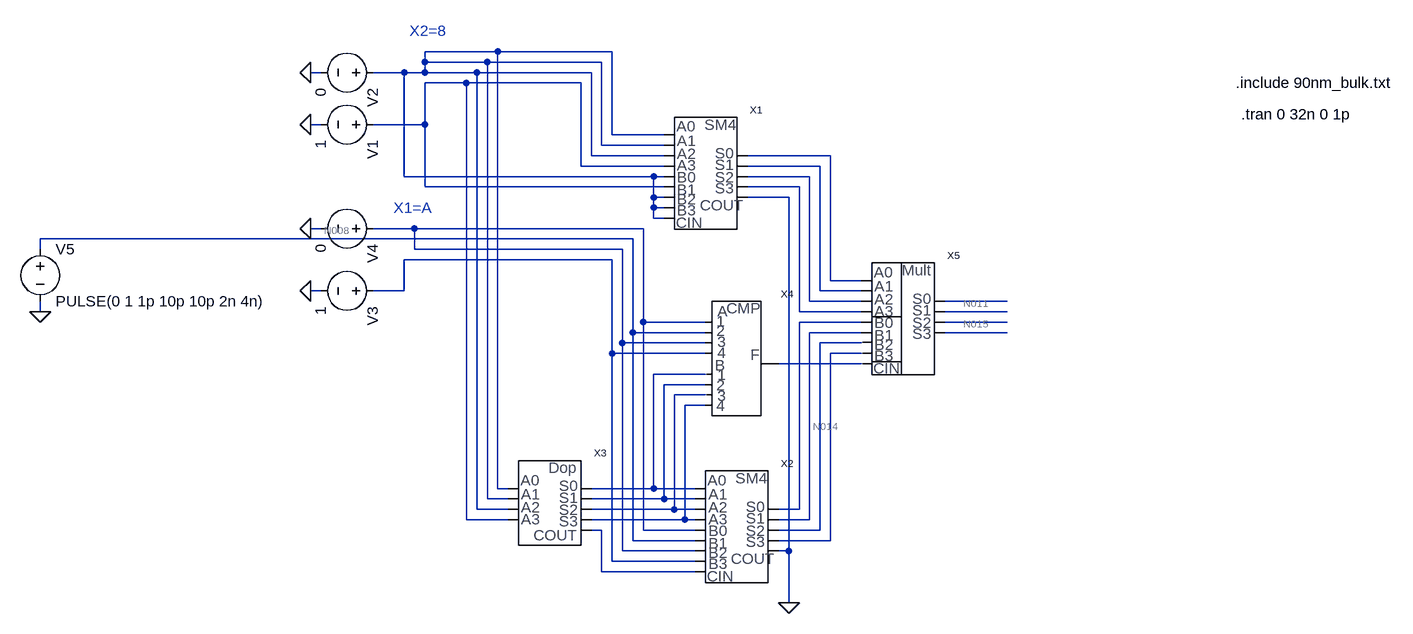
[diagram p0: schematic Final.asc]
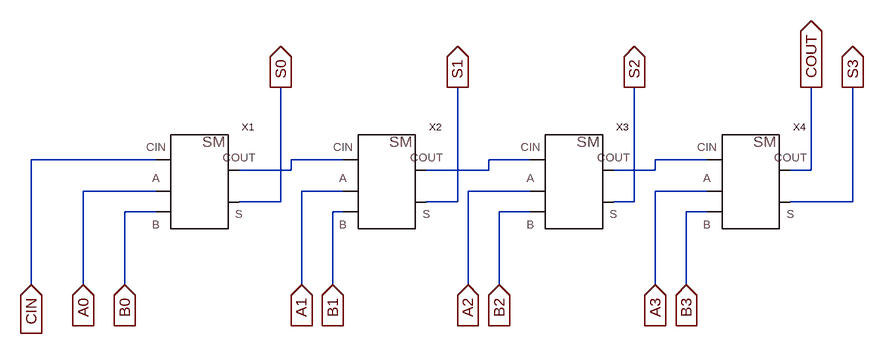
[diagram p1: sub-circuit sum4.asc]
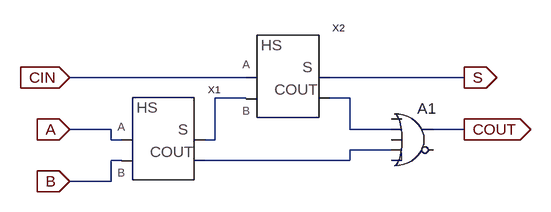
[diagram p2: sub-circuit fullsum.asc]
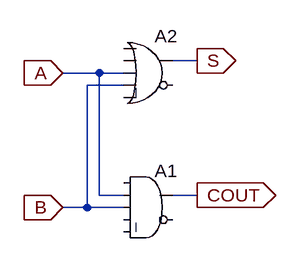
[diagram p3: sub-circuit halfsum.asc]
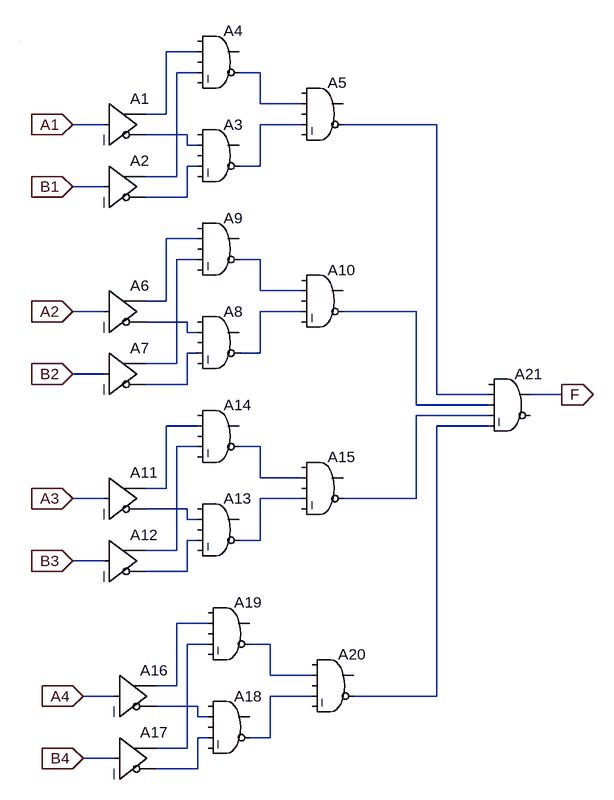
[diagram p4: sub-circuit comparator.asc]
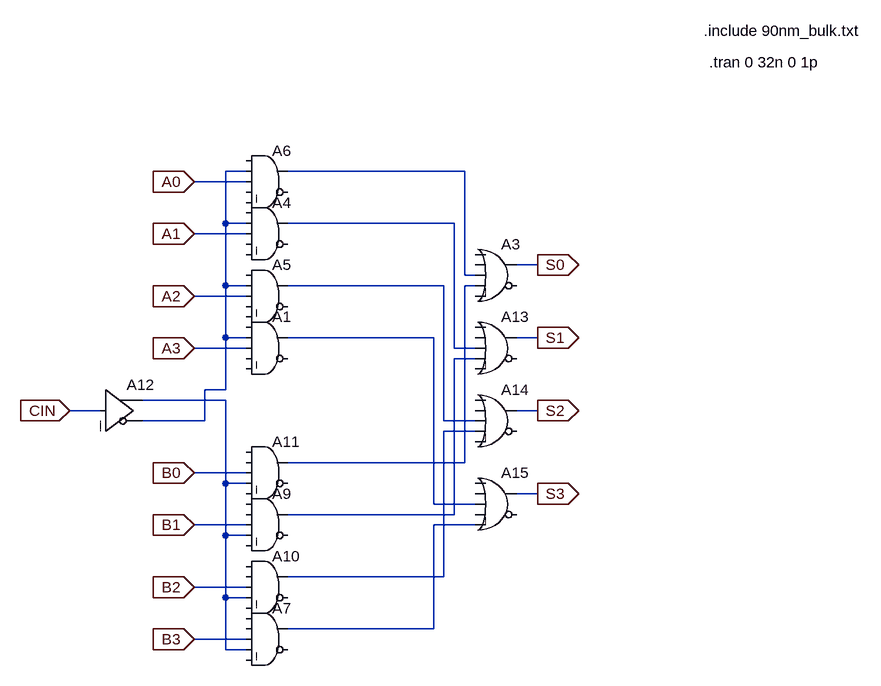
[diagram p5: sub-circuit multy.asc]
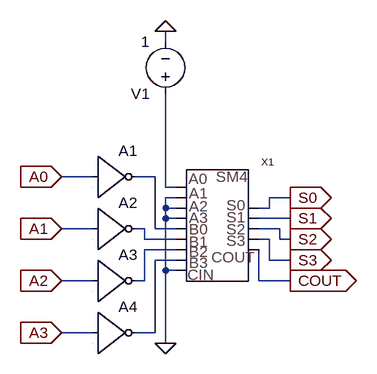
[diagram p6: sub-circuit dopcode.asc]
Final.asc, the LTspice schematic file:
Version 4
SHEET 1 1272 756
WIRE -496 -384 -608 -384
WIRE -320 -384 -496 -384
WIRE -608 -368 -608 -384
WIRE -512 -368 -608 -368
WIRE -336 -368 -512 -368
WIRE -768 -352 -784 -352
WIRE -640 -352 -688 -352
WIRE -608 -352 -608 -368
WIRE -608 -352 -640 -352
WIRE -528 -352 -608 -352
WIRE -352 -352 -528 -352
WIRE -544 -336 -608 -336
WIRE -368 -336 -544 -336
WIRE -768 -272 -784 -272
WIRE -608 -272 -608 -336
WIRE -608 -272 -688 -272
WIRE -320 -256 -320 -384
WIRE -240 -256 -320 -256
WIRE -336 -240 -336 -368
WIRE -240 -240 -336 -240
WIRE -352 -224 -352 -352
WIRE -240 -224 -352 -224
WIRE 16 -224 -112 -224
WIRE -368 -208 -368 -336
WIRE -240 -208 -368 -208
WIRE 0 -208 -112 -208
WIRE -640 -192 -640 -352
WIRE -256 -192 -640 -192
WIRE -240 -192 -256 -192
WIRE -16 -192 -112 -192
WIRE -608 -176 -608 -272
WIRE -240 -176 -608 -176
WIRE -32 -176 -112 -176
WIRE -256 -160 -256 -192
WIRE -240 -160 -256 -160
WIRE -48 -160 -112 -160
WIRE -256 -144 -256 -160
WIRE -240 -144 -256 -144
WIRE -256 -128 -256 -144
WIRE -240 -128 -256 -128
WIRE -768 -112 -784 -112
WIRE -624 -112 -688 -112
WIRE -272 -112 -624 -112
WIRE -288 -96 -1200 -96
WIRE -1200 -80 -1200 -96
WIRE -624 -80 -624 -112
WIRE -304 -80 -624 -80
WIRE -320 -64 -640 -64
WIRE 16 -32 16 -224
WIRE 64 -32 16 -32
WIRE -768 -16 -784 -16
WIRE -640 -16 -640 -64
WIRE -640 -16 -688 -16
WIRE 0 -16 0 -208
WIRE 64 -16 0 -16
WIRE -16 0 -16 -192
WIRE 64 0 -16 0
WIRE 288 0 192 0
WIRE -1200 16 -1200 0
WIRE -32 16 -32 -176
WIRE 64 16 -32 16
WIRE 288 16 192 16
WIRE -272 32 -272 -112
WIRE -176 32 -272 32
WIRE 64 32 -32 32
WIRE 288 32 192 32
WIRE -288 48 -288 -96
WIRE -176 48 -288 48
WIRE 64 48 -16 48
WIRE 288 48 192 48
WIRE -304 64 -304 -80
WIRE -176 64 -304 64
WIRE 64 64 0 64
WIRE -320 80 -320 -64
WIRE -176 80 -320 80
WIRE 64 80 16 80
WIRE 64 96 -64 96
WIRE -176 112 -256 112
WIRE -176 128 -240 128
WIRE -176 144 -224 144
WIRE -176 160 -208 160
WIRE -496 288 -496 -384
WIRE -480 288 -496 288
WIRE -256 288 -256 112
WIRE -256 288 -352 288
WIRE -192 288 -256 288
WIRE -512 304 -512 -368
WIRE -480 304 -512 304
WIRE -240 304 -240 128
WIRE -240 304 -352 304
WIRE -192 304 -240 304
WIRE -528 320 -528 -352
WIRE -480 320 -528 320
WIRE -224 320 -224 144
WIRE -224 320 -352 320
WIRE -192 320 -224 320
WIRE -32 320 -32 32
WIRE -32 320 -64 320
WIRE -544 336 -544 -336
WIRE -480 336 -544 336
WIRE -208 336 -208 160
WIRE -208 336 -352 336
WIRE -192 336 -208 336
WIRE -16 336 -16 48
WIRE -16 336 -64 336
WIRE -336 352 -352 352
WIRE -272 352 -272 32
WIRE -192 352 -272 352
WIRE 0 352 0 64
WIRE 0 352 -64 352
WIRE -288 368 -288 48
WIRE -192 368 -288 368
WIRE 16 368 16 80
WIRE 16 368 -64 368
WIRE -304 384 -304 64
WIRE -192 384 -304 384
WIRE -48 384 -48 -160
WIRE -48 384 -64 384
WIRE -320 400 -320 80
WIRE -192 400 -320 400
WIRE -336 416 -336 352
WIRE -192 416 -336 416
WIRE -48 464 -48 384
FLAG -784 -272 0
FLAG -784 -352 0
FLAG -784 -16 0
FLAG -784 -112 0
FLAG -48 464 0
FLAG -1200 16 0
SYMBOL SUM4 -160 -192 R0
SYMATTR InstName X1
SYMBOL SUM4 -112 352 R0
SYMATTR InstName X2
SYMBOL comparator -128 96 R0
SYMATTR InstName X4
SYMBOL voltage -672 -272 R90
WINDOW 123 0 0 Left 2
WINDOW 39 0 0 Left 2
SYMATTR InstName V1
SYMATTR Value 1
SYMBOL voltage -672 -352 R90
WINDOW 123 0 0 Left 2
WINDOW 39 0 0 Left 2
SYMATTR InstName V2
SYMATTR Value 0
SYMBOL voltage -672 -16 R90
WINDOW 123 0 0 Left 2
WINDOW 39 0 0 Left 2
SYMATTR InstName V3
SYMATTR Value 1
SYMBOL voltage -672 -112 R90
WINDOW 123 0 0 Left 2
WINDOW 39 0 0 Left 2
SYMATTR InstName V4
SYMATTR Value 0
SYMBOL Multy 144 32 R0
SYMATTR InstName X5
SYMBOL DopCode -400 336 R0
SYMATTR InstName X3
SYMBOL voltage -1200 -96 R0
WINDOW 123 0 0 Left 2
WINDOW 39 0 0 Left 2
SYMATTR InstName V5
SYMATTR Value PULSE(0 1 1p 10p 10p 2n 4n)
TEXT 640 -336 Left 2 !.include 90nm_bulk.txt
TEXT 648 -288 Left 2 !.tran 0 32n 0 1p
TEXT -632 -416 Left 2 ;X2=8
TEXT -656 -144 Left 2 ;X1=A

sum4.asc, the sub-circuit schematic file:
Version 4
SHEET 1 1244 680
WIRE 96 128 -96 128
WIRE 384 128 304 128
WIRE 672 128 608 128
WIRE 944 128 864 128
WIRE 304 144 304 128
WIRE 304 144 224 144
WIRE 608 144 608 128
WIRE 608 144 512 144
WIRE 864 144 864 128
WIRE 864 144 800 144
WIRE 1104 144 1104 16
WIRE 1104 144 1072 144
WIRE 96 176 -16 176
WIRE 384 176 320 176
WIRE 672 176 576 176
WIRE 944 176 864 176
WIRE 288 192 288 16
WIRE 288 192 224 192
WIRE 560 192 560 16
WIRE 560 192 512 192
WIRE 832 192 832 16
WIRE 832 192 800 192
WIRE 1168 192 1168 16
WIRE 1168 192 1072 192
WIRE 96 208 48 208
WIRE 384 208 368 208
WIRE 672 208 624 208
WIRE 944 208 912 208
WIRE -96 320 -96 128
WIRE -16 320 -16 176
WIRE 48 320 48 208
WIRE 320 320 320 176
WIRE 368 320 368 208
WIRE 576 320 576 176
WIRE 624 320 624 208
WIRE 864 320 864 176
WIRE 912 320 912 208
FLAG -16 320 A0
IOPIN -16 320 In
FLAG 320 320 A1
IOPIN 320 320 In
FLAG 576 320 A2
IOPIN 576 320 In
FLAG 864 320 A3
IOPIN 864 320 In
FLAG -96 320 CIN
IOPIN -96 320 In
FLAG 48 320 B0
IOPIN 48 320 In
FLAG 368 320 B1
IOPIN 368 320 In
FLAG 624 320 B2
IOPIN 624 320 In
FLAG 912 320 B3
IOPIN 912 320 In
FLAG 288 16 S0
IOPIN 288 16 Out
FLAG 560 16 S1
IOPIN 560 16 Out
FLAG 832 16 S2
IOPIN 832 16 Out
FLAG 1104 16 COUT
IOPIN 1104 16 Out
FLAG 1168 16 S3
IOPIN 1168 16 Out
SYMBOL fullsum 160 160 R0
SYMATTR InstName X1
SYMBOL fullsum 448 160 R0
SYMATTR InstName X2
SYMBOL fullsum 736 160 R0
SYMATTR InstName X3
SYMBOL fullsum 1008 160 R0
SYMATTR InstName X4

fullsum.asc, the sub-circuit schematic file:
Version 4
SHEET 1 880 680
WIRE 400 64 128 64
WIRE 736 64 528 64
WIRE 400 96 352 96
WIRE 560 96 528 96
WIRE 192 144 128 144
WIRE 560 144 560 96
WIRE 624 144 560 144
WIRE 736 144 688 144
WIRE 192 160 192 144
WIRE 208 160 192 160
WIRE 352 160 352 96
WIRE 352 160 336 160
WIRE 624 176 560 176
WIRE 208 192 192 192
WIRE 560 192 560 176
WIRE 560 192 336 192
WIRE 192 224 192 192
WIRE 192 224 128 224
FLAG 128 144 A
IOPIN 128 144 In
FLAG 128 224 B
IOPIN 128 224 In
FLAG 128 64 CIN
IOPIN 128 64 In
FLAG 736 144 COUT
IOPIN 736 144 Out
FLAG 736 64 S
IOPIN 736 64 Out
SYMBOL halfsum 240 176 R0
SYMATTR InstName X1
SYMBOL halfsum 432 80 R0
SYMATTR InstName X2
SYMBOL Digital\\or 656 96 R0
SYMATTR InstName A1

halfsum.asc, the sub-circuit schematic file:
Version 4
SHEET 1 880 680
WIRE 272 -48 240 -48
WIRE 144 -32 96 -32
WIRE 176 -32 144 -32
WIRE 176 -16 128 -16
WIRE 144 128 144 -32
WIRE 176 128 144 128
WIRE 272 128 240 128
WIRE 128 144 128 -16
WIRE 128 144 96 144
WIRE 176 144 128 144
FLAG 96 -32 A
IOPIN 96 -32 In
FLAG 96 144 B
IOPIN 96 144 In
FLAG 272 -48 S
IOPIN 272 -48 Out
FLAG 272 128 COUT
IOPIN 272 128 Out
SYMBOL Digital\\and 208 80 R0
SYMATTR InstName A1
SYMBOL Digital\\or 208 -96 R0
SYMATTR InstName A2

comparator.asc, the sub-circuit schematic file:
Version 4
SHEET 1 900 1176
WIRE 272 16 224 16
WIRE 272 48 240 48
WIRE 368 48 336 48
WIRE 368 96 368 48
WIRE 432 96 368 96
WIRE 224 112 224 16
WIRE 224 112 192 112
WIRE 128 128 80 128
WIRE 432 128 368 128
WIRE 640 128 496 128
WIRE 256 144 192 144
WIRE 256 160 256 144
WIRE 272 160 256 160
WIRE 272 192 256 192
WIRE 368 192 368 128
WIRE 368 192 336 192
WIRE 240 208 240 48
WIRE 240 208 192 208
WIRE 128 224 80 224
WIRE 256 240 256 192
WIRE 256 240 192 240
WIRE 272 304 224 304
WIRE 272 336 240 336
WIRE 368 336 336 336
WIRE 368 384 368 336
WIRE 432 384 368 384
WIRE 224 400 224 304
WIRE 224 400 192 400
WIRE 128 416 80 416
WIRE 432 416 368 416
WIRE 608 416 496 416
WIRE 256 432 192 432
WIRE 256 448 256 432
WIRE 272 448 256 448
WIRE 272 480 256 480
WIRE 368 480 368 416
WIRE 368 480 336 480
WIRE 240 496 240 336
WIRE 240 496 192 496
WIRE 128 512 80 512
WIRE 256 528 256 480
WIRE 256 528 192 528
WIRE 640 544 640 128
WIRE 720 544 640 544
WIRE 832 544 784 544
WIRE 608 560 608 416
WIRE 720 560 608 560
WIRE 720 576 608 576
WIRE 272 592 224 592
WIRE 720 592 640 592
WIRE 272 624 240 624
WIRE 368 624 336 624
WIRE 368 672 368 624
WIRE 432 672 368 672
WIRE 224 688 224 592
WIRE 224 688 192 688
WIRE 128 704 80 704
WIRE 432 704 368 704
WIRE 608 704 608 576
WIRE 608 704 496 704
WIRE 256 720 192 720
WIRE 256 736 256 720
WIRE 272 736 256 736
WIRE 272 768 256 768
WIRE 368 768 368 704
WIRE 368 768 336 768
WIRE 240 784 240 624
WIRE 240 784 192 784
WIRE 128 800 80 800
WIRE 256 816 256 768
WIRE 256 816 192 816
WIRE 288 896 240 896
WIRE 288 928 256 928
WIRE 384 928 352 928
WIRE 384 976 384 928
WIRE 448 976 384 976
WIRE 240 992 240 896
WIRE 240 992 208 992
WIRE 144 1008 96 1008
WIRE 448 1008 384 1008
WIRE 640 1008 640 592
WIRE 640 1008 512 1008
WIRE 272 1024 208 1024
WIRE 272 1040 272 1024
WIRE 288 1040 272 1040
WIRE 288 1072 272 1072
WIRE 384 1072 384 1008
WIRE 384 1072 352 1072
WIRE 256 1088 256 928
WIRE 256 1088 208 1088
WIRE 144 1104 96 1104
WIRE 272 1120 272 1072
WIRE 272 1120 208 1120
WIRE 0 0 0 0
FLAG 80 128 A1
IOPIN 80 128 In
FLAG 80 224 B1
IOPIN 80 224 In
FLAG 80 416 A2
IOPIN 80 416 In
FLAG 80 512 B2
IOPIN 80 512 In
FLAG 80 704 A3
IOPIN 80 704 In
FLAG 80 800 B3
IOPIN 80 800 In
FLAG 96 1008 A4
IOPIN 96 1008 In
FLAG 96 1104 B4
IOPIN 96 1104 In
FLAG 832 544 F
IOPIN 832 544 Out
SYMBOL Digital\\buf 128 64 R0
SYMATTR InstName A1
SYMBOL Digital\\buf 128 160 R0
SYMATTR InstName A2
SYMBOL Digital\\and 304 112 R0
SYMATTR InstName A3
SYMBOL Digital\\and 304 -32 R0
SYMATTR InstName A4
SYMBOL Digital\\and 464 48 R0
SYMATTR InstName A5
SYMBOL Digital\\buf 128 352 R0
SYMATTR InstName A6
SYMBOL Digital\\buf 128 448 R0
SYMATTR InstName A7
SYMBOL Digital\\and 304 400 R0
SYMATTR InstName A8
SYMBOL Digital\\and 304 256 R0
SYMATTR InstName A9
SYMBOL Digital\\and 464 336 R0
SYMATTR InstName A10
SYMBOL Digital\\buf 128 640 R0
SYMATTR InstName A11
SYMBOL Digital\\buf 128 736 R0
SYMATTR InstName A12
SYMBOL Digital\\and 304 688 R0
SYMATTR InstName A13
SYMBOL Digital\\and 304 544 R0
SYMATTR InstName A14
SYMBOL Digital\\and 464 624 R0
SYMATTR InstName A15
SYMBOL Digital\\buf 144 944 R0
SYMATTR InstName A16
SYMBOL Digital\\buf 144 1040 R0
SYMATTR InstName A17
SYMBOL Digital\\and 320 992 R0
SYMATTR InstName A18
SYMBOL Digital\\and 320 848 R0
SYMATTR InstName A19
SYMBOL Digital\\and 480 928 R0
SYMATTR InstName A20
SYMBOL Digital\\and 752 496 R0
SYMATTR InstName A21

multy.asc, the sub-circuit schematic file:
Version 4
SHEET 1 1080 776
WIRE 80 -80 48 -80
WIRE 416 -80 144 -80
WIRE 80 -64 0 -64
WIRE 48 0 48 -80
WIRE 80 0 48 0
WIRE 400 0 144 0
WIRE 80 16 0 16
WIRE 528 64 496 64
WIRE 416 80 416 -80
WIRE 432 80 416 80
WIRE 48 96 48 0
WIRE 80 96 48 96
WIRE 384 96 144 96
WIRE 432 96 416 96
WIRE 80 112 0 112
WIRE 48 176 48 96
WIRE 80 176 48 176
WIRE 368 176 144 176
WIRE 528 176 496 176
WIRE 80 192 0 192
WIRE 400 192 400 0
WIRE 432 192 400 192
WIRE 432 208 400 208
WIRE 48 256 48 176
WIRE 48 256 16 256
WIRE 48 272 -80 272
WIRE -144 288 -192 288
WIRE 528 288 496 288
WIRE 16 304 16 256
WIRE 16 304 -80 304
WIRE 384 304 384 96
WIRE 432 304 384 304
WIRE 432 320 384 320
WIRE 416 368 416 96
WIRE 416 368 144 368
WIRE 80 384 0 384
WIRE 48 400 48 272
WIRE 80 400 48 400
WIRE 528 416 496 416
WIRE 368 432 368 176
WIRE 432 432 368 432
WIRE 400 448 400 208
WIRE 400 448 144 448
WIRE 80 464 0 464
WIRE 432 464 368 464
WIRE 48 480 48 400
WIRE 80 480 48 480
WIRE 384 544 384 320
WIRE 384 544 144 544
WIRE 80 560 0 560
WIRE 48 576 48 480
WIRE 80 576 48 576
WIRE 368 624 368 464
WIRE 368 624 144 624
WIRE 80 640 0 640
WIRE 48 656 48 576
WIRE 80 656 48 656
FLAG 528 64 S0
IOPIN 528 64 Out
FLAG 528 176 S1
IOPIN 528 176 Out
FLAG 528 288 S2
IOPIN 528 288 Out
FLAG 528 416 S3
IOPIN 528 416 Out
FLAG -192 288 CIN
IOPIN -192 288 In
FLAG 0 384 B0
IOPIN 0 384 In
FLAG 0 464 B1
IOPIN 0 464 In
FLAG 0 560 B2
IOPIN 0 560 In
FLAG 0 640 B3
IOPIN 0 640 In
FLAG 0 192 A3
IOPIN 0 192 In
FLAG 0 112 A2
IOPIN 0 112 In
FLAG 0 16 A1
IOPIN 0 16 In
FLAG 0 -64 A0
IOPIN 0 -64 In
SYMBOL Digital\\and 112 128 R0
SYMATTR InstName A1
SYMBOL Digital\\and 112 -48 R0
SYMATTR InstName A4
SYMBOL Digital\\and 112 48 R0
SYMATTR InstName A5
SYMBOL Digital\\and 112 -128 R0
SYMATTR InstName A6
SYMBOL Digital\\and 112 576 R0
SYMATTR InstName A7
SYMBOL Digital\\and 112 400 R0
SYMATTR InstName A9
SYMBOL Digital\\and 112 496 R0
SYMATTR InstName A10
SYMBOL Digital\\and 112 320 R0
SYMATTR InstName A11
SYMBOL Digital\\buf -144 224 R0
SYMATTR InstName A12
SYMBOL Digital\\or 464 16 R0
SYMATTR InstName A3
SYMBOL Digital\\or 464 128 R0
SYMATTR InstName A13
SYMBOL Digital\\or 464 240 R0
SYMATTR InstName A14
SYMBOL Digital\\or 464 368 R0
SYMATTR InstName A15
TEXT 784 -296 Left 2 !.include 90nm_bulk.txt
TEXT 792 -248 Left 2 !.tran 0 32n 0 1p

dopcode.asc, the sub-circuit schematic file:
Version 4
SHEET 1 880 680
WIRE 256 -128 256 -144
WIRE 144 80 96 80
WIRE 240 80 208 80
WIRE 256 96 256 -48
WIRE 272 96 256 96
WIRE 272 112 256 112
WIRE 448 112 416 112
WIRE 256 128 256 112
WIRE 272 128 256 128
WIRE 416 128 416 112
WIRE 416 128 400 128
WIRE 256 144 256 128
WIRE 272 144 256 144
WIRE 448 144 400 144
WIRE 144 160 96 160
WIRE 224 160 208 160
WIRE 240 160 240 80
WIRE 272 160 240 160
WIRE 432 160 400 160
WIRE 224 176 224 160
WIRE 272 176 224 176
WIRE 416 176 400 176
WIRE 432 176 432 160
WIRE 448 176 432 176
WIRE 272 192 224 192
WIRE 272 208 240 208
WIRE 416 208 416 176
WIRE 448 208 416 208
WIRE 256 224 256 144
WIRE 272 224 256 224
WIRE 144 240 96 240
WIRE 224 240 224 192
WIRE 224 240 208 240
WIRE 400 240 400 192
WIRE 448 240 400 240
WIRE 144 320 96 320
WIRE 240 320 240 208
WIRE 240 320 208 320
WIRE 256 336 256 224
FLAG 256 -144 0
FLAG 96 80 A0
IOPIN 96 80 In
FLAG 96 160 A1
IOPIN 96 160 In
FLAG 96 240 A2
IOPIN 96 240 In
FLAG 96 320 A3
IOPIN 96 320 In
FLAG 448 112 S0
IOPIN 448 112 Out
FLAG 448 144 S1
IOPIN 448 144 Out
FLAG 448 176 S2
IOPIN 448 176 Out
FLAG 448 208 S3
IOPIN 448 208 Out
FLAG 448 240 COUT
IOPIN 448 240 Out
FLAG 256 336 0
SYMBOL Digital\\inv 144 16 R0
SYMATTR InstName A1
SYMBOL Digital\\inv 144 96 R0
SYMATTR InstName A2
SYMBOL Digital\\inv 144 176 R0
SYMATTR InstName A3
SYMBOL Digital\\inv 144 256 R0
SYMATTR InstName A4
SYMBOL voltage 256 -32 R180
WINDOW 123 0 0 Left 2
WINDOW 39 0 0 Left 2
SYMATTR InstName V1
SYMATTR Value 1
SYMBOL SUM4 352 160 R0
SYMATTR InstName X1

The netlist it stands for:
* Final.asc
XX1 N001 N001 N001 N002 N001 N003 N004 N005 N006 0 N001 N002 N001 N001 sum4
XX2 N019 N020 N021 N022 N023 N012 N014 N016 N017 0 N007 N008 N007 N009 sum4
XX4 N007 N008 N007 N009 N019 N020 N021 N022 N018 comparator
V1 N002 0 1
V2 N001 0 0
V3 N009 0 1
V4 N007 0 0
XX5 N003 N004 N005 N006 N012 N010 N011 N013 N015 N014 N016 N017 N018 multy
XX3 N001 N001 N001 N002 N019 N020 N021 N022 N023 dopcode
V5 N008 0 PULSE(0 1 1p 10p 10p 2n 4n)

* block symbol definitions
.subckt sum4 A0 A1 A2 A3 CIN S0 S1 S2 S3 COUT B0 B1 B2 B3
XX1 CIN A0 B0 N001 S0 fullsum
XX2 N001 A1 B1 N002 S1 fullsum
XX3 N002 A2 B2 N003 S2 fullsum
XX4 N003 A3 B3 COUT S3 fullsum
.ends sum4

.subckt fullsum CIN A B COUT S
XX1 A B N001 N003 halfsum
XX2 CIN N001 S N002 halfsum
A1 0 N002 0 N003 0 0 COUT 0 OR
.ends fullsum

.subckt halfsum A B S COUT
A1 0 A B 0 0 0 COUT 0 AND
A2 0 0 A B 0 0 S 0 OR
.ends halfsum

.subckt comparator A1 A2 A3 A4 B1 B2 B3 B4 F
A1 A1 0 0 0 0 N006 N001 0 BUF
A2 B1 0 0 0 0 N007 N002 0 BUF
A3 0 N006 0 N007 0 N004 0 0 AND
A4 0 N001 0 N002 0 N003 0 0 AND
A5 0 N003 0 N004 0 N005 0 0 AND
A6 A2 0 0 0 0 N013 N008 0 BUF
A7 B2 0 0 0 0 N014 N009 0 BUF
A8 0 N013 0 N014 0 N011 0 0 AND
A9 0 N008 0 N009 0 N010 0 0 AND
A10 0 N010 0 N011 0 N012 0 0 AND
A11 A3 0 0 0 0 N021 N016 0 BUF
A12 B3 0 0 0 0 N022 N018 0 BUF
A13 0 N021 0 N022 0 N020 0 0 AND
A14 0 N016 0 N018 0 N019 0 0 AND
A15 0 N019 0 N020 0 N015 0 0 AND
A16 A4 0 0 0 0 N027 N023 0 BUF
A17 B4 0 0 0 0 N028 N024 0 BUF
A18 0 N027 0 N028 0 N026 0 0 AND
A19 0 N023 0 N024 0 N025 0 0 AND
A20 0 N025 0 N026 0 N017 0 0 AND
A21 0 N005 N012 N015 N017 0 F 0 AND
.ends comparator

.subckt multy A0 A1 A2 A3 B0 S0 S1 S2 S3 B1 B2 B3 CIN
A1 0 N001 A3 0 0 0 N006 0 AND
A4 0 N001 A1 0 0 0 N003 0 AND
A5 0 N001 A2 0 0 0 N004 0 AND
A6 0 N001 A0 0 0 0 N002 0 AND
A7 0 0 B3 N008 0 0 N010 0 AND
A9 0 0 B1 N008 0 0 N007 0 AND
A10 0 0 B2 N008 0 0 N009 0 AND
A11 0 0 B0 N008 0 0 N005 0 AND
A12 CIN 0 0 0 0 N001 N008 0 BUF
A3 0 0 N002 N005 0 0 S0 0 OR
A13 0 0 N003 N007 0 0 S1 0 OR
A14 0 0 N004 N009 0 0 S2 0 OR
A15 0 0 N006 0 N010 0 S3 0 OR
.include 90nm_bulk.txt
.tran 0 32n 0 1p
.ends multy

.subckt dopcode A0 A1 A2 A3 S0 S1 S2 S3 COUT
A1 A0 0 0 0 0 N001 0 0 BUF
A2 A1 0 0 0 0 N003 0 0 BUF
A3 A2 0 0 0 0 N004 0 0 BUF
A4 A3 0 0 0 0 N005 0 0 BUF
V1 N002 0 1
XX1 N002 0 0 0 0 S0 S1 S2 S3 COUT N001 N003 N004 N005 sum4
.ends dopcode

.include 90nm_bulk.txt
.tran 0 32n 0 1p
* X2=8
* X1=A
.backanno
.end

* Results of the author's LTspice run, read from the files saved beside the schematic
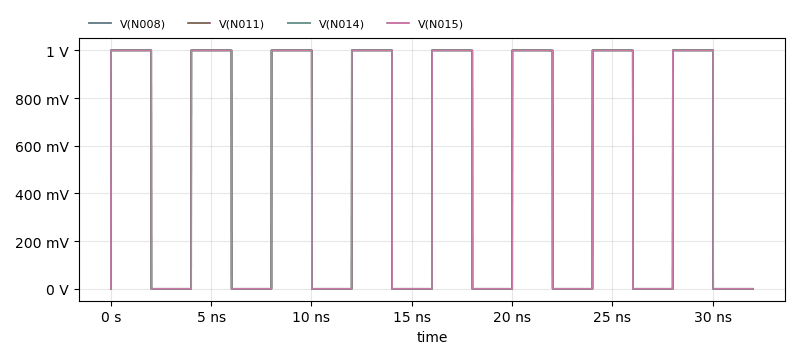
[diagram p7: Transient Analysis of Final.asc, plotted from the saved traces]
* Transient Analysis, 1 run:
*   V(N008): min 0 V, max 1 V, average 502.5 mV, rms 708.3 mV, last 0 V
*   V(N011): min 0 V, max 1 V, average 502.5 mV, rms 708.7 mV, last 0 V
*   V(N014): min 0 V, max 1 V, average 502.5 mV, rms 708.7 mV, last 0 V
*   V(N015): min 0 V, max 1 V, average 502.5 mV, rms 708.7 mV, last 0 V